# EAGLE design fourChannel-nMOSFET (EAGLE 7.2.0)
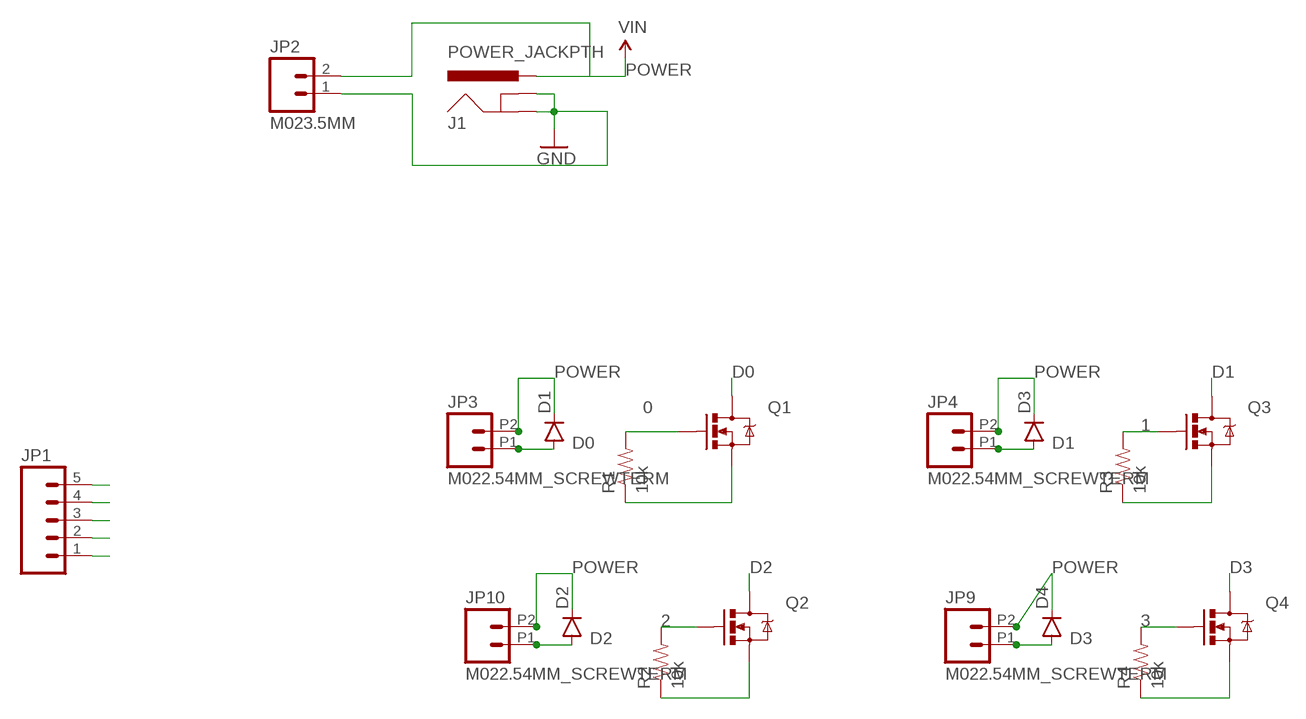
[diagram p0: schematic, sheet 1]

## Parts
D1  DIODEPTH  [DIODE-1N4001]
D2  DIODEPTH  [DIODE-1N4001]
D3  DIODEPTH  [DIODE-1N4001]
D4  DIODEPTH  [DIODE-1N4001]
J1  POWER_JACKPTH  [POWER_JACK_PTH]
JP1  M05NO_SILK  [1X05_NO_SILK]
JP2  M023.5MM  [SCREWTERMINAL-3.5MM-2]
JP3  M022.54MM_SCREWTERM  [1X02_2.54_SCREWTERM]
JP4  M022.54MM_SCREWTERM  [1X02_2.54_SCREWTERM]
JP9  M022.54MM_SCREWTERM  [1X02_2.54_SCREWTERM]
JP10  M022.54MM_SCREWTERM  [1X02_2.54_SCREWTERM]
Q1  MOSFET-NCHANNELFQP30N06L  [TO220V]
Q2  MOSFET-NCHANNELFQP30N06L  [TO220V]
Q3  MOSFET-NCHANNELFQP30N06L  [TO220V]
Q4  MOSFET-NCHANNELFQP30N06L  [TO220V]
R1  10k  10KOHM-1/4W5%(PTH)  [AXIAL-0.3]
R2  10k  10KOHM-1/4W5%(PTH)  [AXIAL-0.3]
R3  10k  10KOHM-1/4W5%(PTH)  [AXIAL-0.3]
R4  10k  10KOHM-1/4W5%(PTH)  [AXIAL-0.3]

## Nets
0: JP1.1 Q1.1(G) R1.P$2
1: JP1.2 Q3.1(G) R3.P$2
2: JP1.3 Q2.1(G) R2.P$2
3: JP1.4 Q4.1(G) R4.P$2
D0: D1.A JP3.P1 Q1.2(D)
D1: D3.A JP4.P1 Q3.2(D)
D2: D2.A JP10.P1 Q2.2(D)
D3: D4.A JP9.P1 Q4.2(D)
GND: J1.GND J1.GNDBREAK JP1.5 JP2.1 Q1.3(S) Q2.3(S) Q3.3(S) Q4.3(S) R1.P$1 R2.P$1 R3.P$1 R4.P$1
POWER: D1.C D2.C D3.C D4.C J1.PWR JP2.2 JP3.P2 JP4.P2 JP9.P2 JP10.P2 ; supply symbol labelled VIN

## Library data of the parts
D1-D4 = SparkFun-DiscreteSemi:DIODE: Diode These are standard reverse protection diodes and small signal diodes. SMA package can handle up to about 1A. SOD-323 can handle about 200mA. What the SOD-323 package when ordering, there are some mfgs out there that are 5-pin packages.
J1 = SparkFun-Connectors:POWER_JACK: Power Jack This is the standard 5.5mm barrel jack for power. The PTH is the most common, proven, reliable, footprint. The Slot footprint only works if the mill layer is transmitted to the PCB fab house so be warned. Mating wall wart : TOL-00298 (and others); PROD_ID: PRT-00119
JP1 = SparkFun-Connectors:M05: Header 5 Standard 5-pin 0.1" header. Use with straight break away headers (SKU : PRT-00116), right angle break away headers (PRT-00553), swiss pins (PRT-00743), machine pins (PRT-00117), and female headers (PRT-00115). Molex polarized connector foot print use with SKU : PRT-08230 with associated crimp pins and housings.
JP2-JP4 JP9 JP10 = SparkFun-Connectors:M02: Standard 2-pin 0.1" header. Use with - straight break away headers ( PRT-00116) - right angle break away headers (PRT-00553) - swiss pins (PRT-00743) - machine pins (PRT-00117) - female headers (PRT-00115) Molex polarized connector foot print use with: PRT-08233 with associated crimp pins and housings. 2.54_SCREWTERM for use with PRT-10571. 3.5mm Screw Terminal footprints for PRT-08084 5mm Screw Terminal footprints for use with PRT-08432
Q1-Q4 = SparkFun-DiscreteSemi:MOSFET-NCHANNEL: Common NMOSFET Parts MFG P/N Store ID Prod ID FDD8780 TRANS-09984 SI7820DN TRANS-11055 FDS6630A IC-08089 2N7002PW TRANS-11151 FQP30N06L COM-10213 TRANS-10060 BSS123LT1G TRANS-08345 BSS138 TRANS-00830 BS170 2N7000; PROD_ID: TRANS-10060
R1-R4 = SparkFun-Resistors:10KOHM-1/4W5%(PTH): RES-09435; PROD_ID: RES-9435

## Board
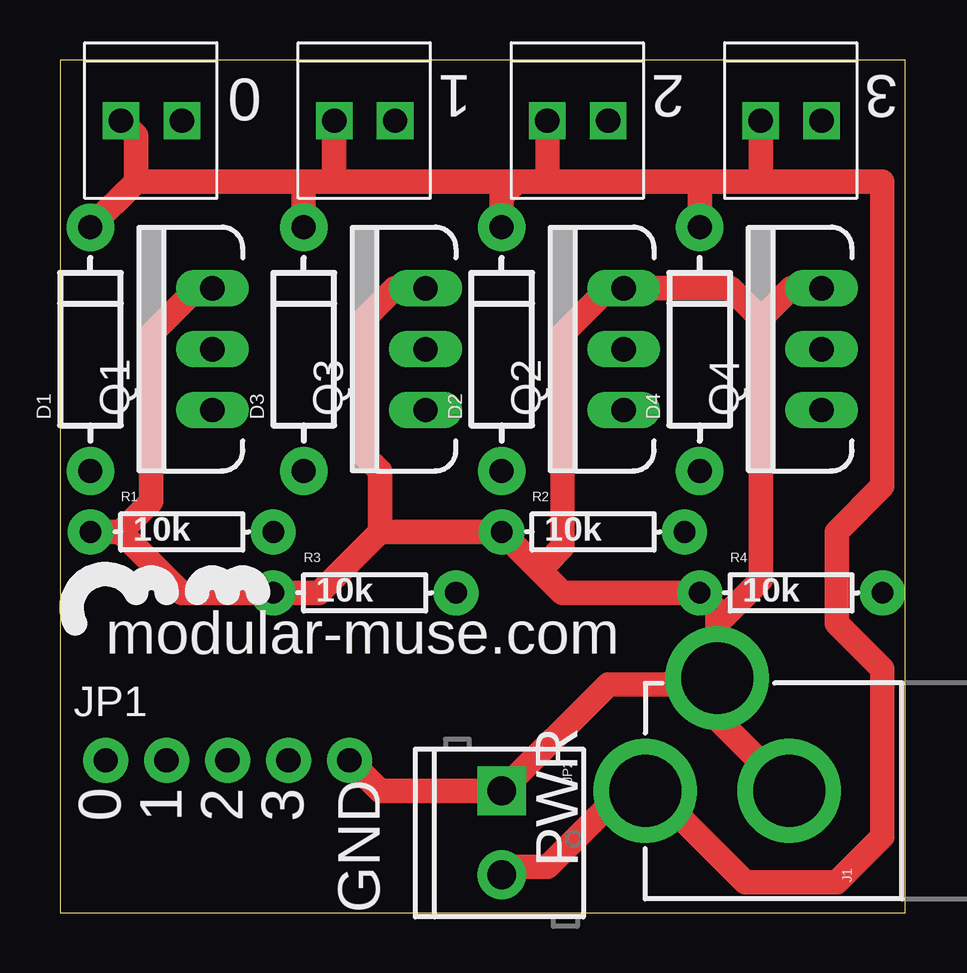
[diagram p1: board, top side]
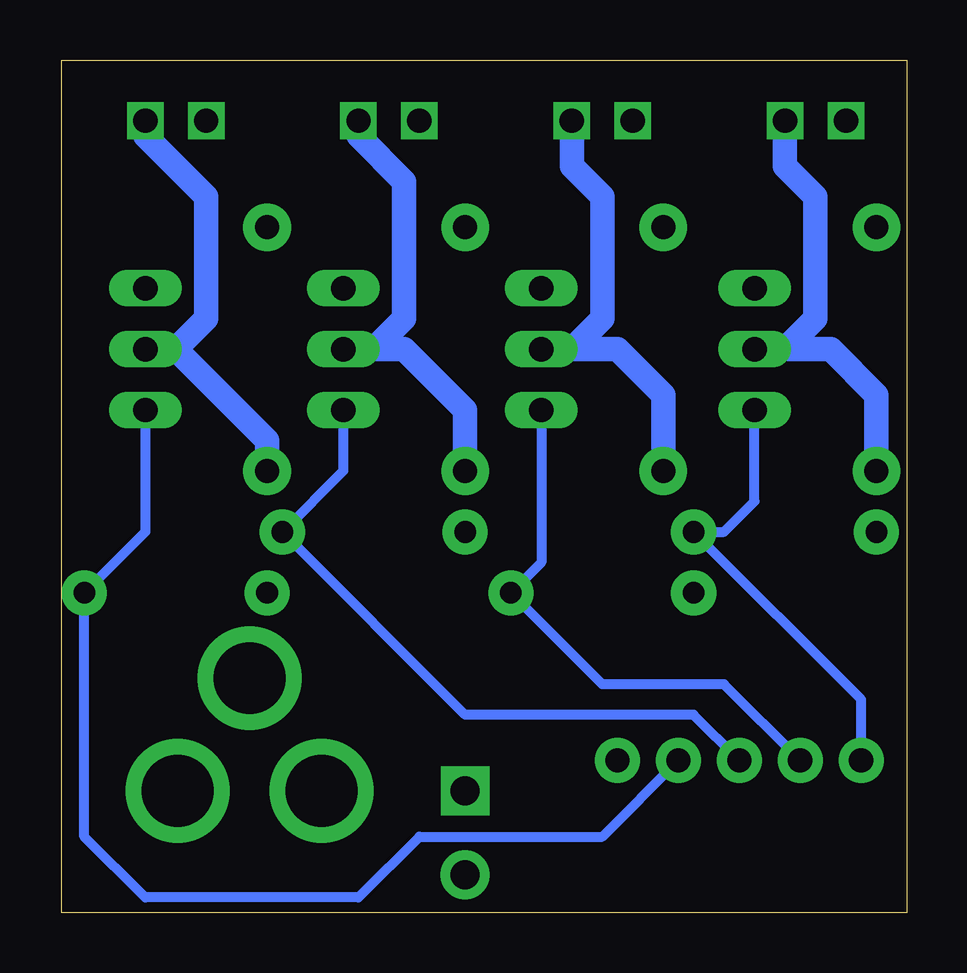
[diagram p2: board, bottom side, seen from below]

Size 35.23 x 35.55 mm. Coordinates in mm from the lower left corner, seen from the top.
Outline: 0,0 35.23,0 35.23,35.55 0,35.55 0,0
Copper layers (1*16): Top 0.035mm / dielectric 1.5mm / Bottom 0.035mm
Design rules "default": minimum track width 10mil, minimum drill 24mil, track to track 8mil, track to pad 8mil, pad to pad 8mil, via to via 8mil, smd to smd 8mil, copper to edge 40mil, drill to drill 8mil, minimum pad ring 10mil, minimum via ring 8mil, stop-mask expansion 4mil, vias tented up to drill 0mil, thermal gap 10mil

### Footprints (pad centres in the part's own frame; a part is rotated, then mirrored left to right if it is on the bottom)
DIODE-1N4001 = drill 1 pad 1.981: A -5.08,0; C 5.08,0
POWER_JACK_PTH = drill 2.997 pad 4.318: GND 0,7.7; GNDBREAK 4.7,10.7; PWR 0,13.7
1X05_NO_SILK = drill 1.016 pad 1.88: 1 0,0; 2 2.54,0; 3 5.08,0; 4 7.62,0; 5 10.16,0
SCREWTERMINAL-3.5MM-2 = drill 1.2 pad 2.032 square: 1 0,0 | drill 1.2 pad 2.032: 2 3.5,0
1X02_2.54_SCREWTERM = drill 1.016 square: P1 2.54,0; P2 0,0
TO220V = drill 1.016 long: 1 -2.54,0; 2 0,0; 3 2.54,0
AXIAL-0.3 = drill 0.9 pad 1.88: P$1 -3.81,0; P$2 3.81,0

### Placement (x,y rotation side)
D1  1.27,23.49 90 top
D2  18.41,23.49 90 top
D3  10.16,23.49 90 top
D4  26.67,23.49 90 top
J1  38.1,5.08 90 top
JP1  1.91,6.35 0 top
JP2  18.41,5.08 270 top
JP3  2.54,33.02 0 top
JP4  11.43,33.02 0 top
JP9  29.21,33.02 0 top
JP10  20.32,33.02 0 top
Q1  6.35,23.49 90 top
Q2  23.5,23.49 90 top
Q3  15.24,23.49 90 top
Q4  31.75,23.49 90 top
R1  5.08,15.88 0 top
R2  22.23,15.88 0 top
R3  12.7,13.34 0 top
R4  30.48,13.34 0 top

### Tracks (layer width: path | path; a pad name or v marks a point on that pad's centre or on a via)
0
  Bottom 0.406: Q1.1 6.35,17.15 7.62,15.88 R1.P$2 1.91,8.89 JP1.1
1
  Bottom 0.406: Q3.1 15.24,14.61 R3.P$2 12.7,9.52 7.62,9.52 JP1.2
2
  Bottom 0.406: JP1.3 8.89,8.26 18.41,8.26 R2.P$2 23.5,18.41 Q2.1
3
  Bottom 0.406: Q4.1 31.75,15.88 R4.P$2 34.29,3.18 31.75,0.63 22.86,0.63 20.32,3.18 12.7,3.18 JP1.4
D0
  Bottom 1.016: D1.A 1.27,21.59 3.17,23.49 Q1.2 5.08,23.49 3.81,24.77 3.81,29.85 5.08,31.12 JP3.P1
D1
  Bottom 1.016: D3.A 10.16,21.59 12.06,23.49 Q3.2 13.97,23.49 12.7,24.77 12.7,29.85 13.97,31.12 JP4.P1
D2
  Bottom 1.016: D2.A 18.41,20.95 20.95,23.49 Q2.2 22.23,23.49 20.95,24.77 20.95,30.48 22.86,32.38 JP10.P1
D3
  Bottom 1.016: 30.48,23.49 29.21,24.77 29.21,29.85 31.75,32.38 JP9.P1 | Q4.2 30.48,23.49 | 30.48,23.49 26.67,19.69 D4.A
GND
  Top 1.016: J1.GNDBREAK 27.4,8.08 J1.GND | J1.GNDBREAK 27.4,12.07 | 27.4,12.07 27.4,12.61 R4.P$1 20.95,13.34 19.68,14.61 | 13.34,15.88 10.79,13.34 R3.P$1 5.08,13.34 2.54,15.88 | Q1.3 5.71,26.04 3.81,24.13 3.81,17.15 2.54,15.88 | 2.54,15.88 R1.P$1 | Q4.3 30.48,26.04 29.21,24.77 | 29.21,24.77 29.21,13.88 27.4,12.07 | 29.21,24.77 27.94,26.04 Q2.3 22.86,26.04 20.95,24.13 20.95,15.24 20.32,14.61 19.68,14.61 | 19.68,14.61 R2.P$1 13.34,15.88 | 13.34,15.88 13.34,18.41 12.7,19.05 12.7,24.77 13.97,26.04 Q3.3 | J1.GNDBREAK 27.14,9.52 22.86,9.52 JP2.1 13.34,5.08 JP1.5
POWER
  Top 1.016: 29.21,30.48 34.29,30.48 34.29,17.78 32.38,15.88 32.38,12.07 34.29,10.16 34.29,3.18 32.38,1.27 28.57,1.27 24.77,5.08 J1.PWR 23.5,5.08 20.32,1.91 18.74,1.91 JP2.2 | 29.21,30.48 26.67,30.48 | 26.67,30.48 20.32,30.48 | 20.32,30.48 19.05,30.48 | 19.05,30.48 11.43,30.48 | 11.43,30.48 10.16,30.48 | 10.16,30.48 3.17,30.48 | 3.17,30.48 D1.C | D3.C 10.16,30.48 | D2.C 18.41,29.85 19.05,30.48 | D4.C 26.67,30.48 | 3.17,30.48 3.17,32.38 JP3.P2 | JP4.P2 11.43,30.48 | JP10.P2 20.32,30.48 | JP9.P2 29.21,30.48

### Text on the board
tPlace: 1 | 2 | 3 | 0 | modular-muse.com | 0 | 1 | 2 | 3 | PWR | GND